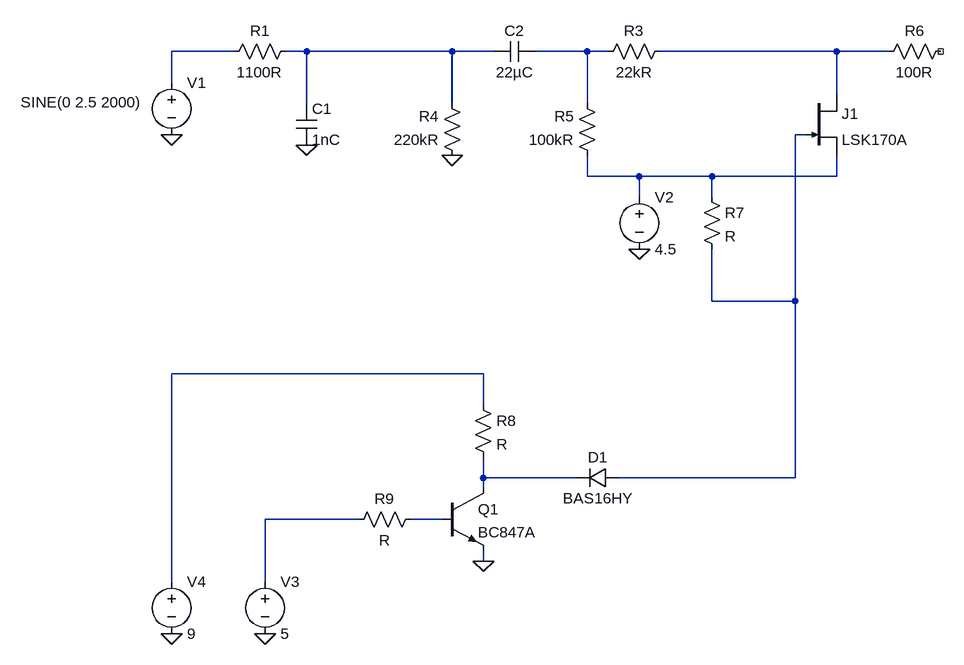
[diagram p0: schematic Audio_input_path.asc]
Audio_input_path.asc, the LTspice schematic file:
Version 4
SHEET 1 880 1012
WIRE -608 96 -704 96
WIRE -496 96 -528 96
WIRE -272 96 -496 96
WIRE -208 96 -272 96
WIRE -64 96 -144 96
WIRE -32 96 -64 96
WIRE 320 96 48 96
WIRE 400 96 320 96
WIRE -704 144 -704 96
WIRE 320 160 320 96
WIRE -496 176 -496 96
WIRE -272 176 -272 96
WIRE -64 176 -64 96
WIRE 272 224 256 224
WIRE -64 288 -64 256
WIRE 16 288 -64 288
WIRE 128 288 16 288
WIRE 320 288 320 256
WIRE 320 288 128 288
WIRE 16 320 16 288
WIRE 128 320 128 288
WIRE 128 480 128 400
WIRE 256 480 256 224
WIRE 256 480 128 480
WIRE -224 592 -704 592
WIRE -224 640 -224 592
WIRE -224 752 -224 720
WIRE -80 752 -224 752
WIRE 256 752 256 480
WIRE 256 752 -16 752
WIRE -224 768 -224 752
WIRE -416 816 -560 816
WIRE -288 816 -336 816
WIRE -224 880 -224 864
WIRE -704 912 -704 592
WIRE -560 912 -560 816
FLAG 16 400 0
FLAG -704 224 0
FLAG -496 240 0
FLAG -272 256 0
FLAG -560 992 0
FLAG -704 992 0
FLAG -224 880 0
SYMBOL njf 272 160 R0
SYMATTR InstName J1
SYMATTR Value LSK170A
SYMBOL res -512 80 R90
WINDOW 0 0 56 VBottom 2
WINDOW 3 32 56 VTop 2
SYMATTR InstName R1
SYMATTR Value 1100R
SYMBOL res 64 80 R90
WINDOW 0 0 56 VBottom 2
WINDOW 3 32 56 VTop 2
SYMATTR InstName R3
SYMATTR Value 22kR
SYMBOL res -256 272 R180
WINDOW 0 36 76 Left 2
WINDOW 3 36 40 Left 2
SYMATTR InstName R4
SYMATTR Value 220kR
SYMBOL res -48 272 R180
WINDOW 0 36 76 Left 2
WINDOW 3 36 40 Left 2
SYMATTR InstName R5
SYMATTR Value 100kR
SYMBOL cap -512 176 R0
SYMATTR InstName C1
SYMATTR Value 1nC
SYMBOL cap -144 80 R90
WINDOW 0 0 32 VBottom 2
WINDOW 3 32 32 VTop 2
SYMATTR InstName C2
SYMATTR Value 22µC
SYMBOL res 496 80 R90
WINDOW 0 0 56 VBottom 2
WINDOW 3 32 56 VTop 2
SYMATTR InstName R6
SYMATTR Value 100R
SYMBOL voltage -704 128 R0
WINDOW 3 -232 46 Left 2
WINDOW 123 0 0 Left 0
WINDOW 39 0 0 Left 0
SYMATTR InstName V1
SYMATTR Value SINE(0 2.5 2000)
SYMBOL voltage 16 304 R0
WINDOW 123 0 0 Left 0
WINDOW 39 0 0 Left 0
SYMATTR InstName V2
SYMATTR Value 4.5
SYMBOL res 112 304 R0
SYMATTR InstName R7
SYMBOL diode -16 736 R90
WINDOW 0 0 32 VBottom 2
WINDOW 3 32 32 VTop 2
SYMATTR InstName D1
SYMATTR Value BAS16HY
SYMBOL res -240 624 R0
SYMATTR InstName R8
SYMBOL res -320 800 R90
WINDOW 0 0 56 VBottom 2
WINDOW 3 32 56 VTop 2
SYMATTR InstName R9
SYMBOL voltage -560 896 R0
WINDOW 123 0 0 Left 0
WINDOW 39 0 0 Left 0
SYMATTR InstName V3
SYMATTR Value 5
SYMBOL voltage -704 896 R0
WINDOW 123 0 0 Left 0
WINDOW 39 0 0 Left 0
SYMATTR InstName V4
SYMATTR Value 9
SYMBOL npn -288 768 R0
SYMATTR InstName Q1
SYMATTR Value BC847A

The netlist it stands for:
* Audio_input_path.asc
J1 N004 N005 N006 LSK170A
R1 N002 N001 1100R
R3 N004 N003 22kR
R4 0 N002 220kR
R5 N006 N003 100kR
C1 N002 0 1nC
C2 N003 N002 22µC
R6 NC_01 N004 100R
V1 N001 0 SINE(0 2.5 2000)
V2 N006 0 4.5
R7 N006 N005 R
D1 N005 N008 BAS16HY
R8 N007 N008 R
R9 N010 N009 R
V3 N009 0 5
V4 N007 0 9
Q1 N008 N010 0 0 BC847A
.model D D
.lib standard.dio
.model NPN NPN
.model PNP PNP
.lib standard.bjt
.model NJF NJF
.model PJF PJF
.lib standard.jft
.backanno
.end